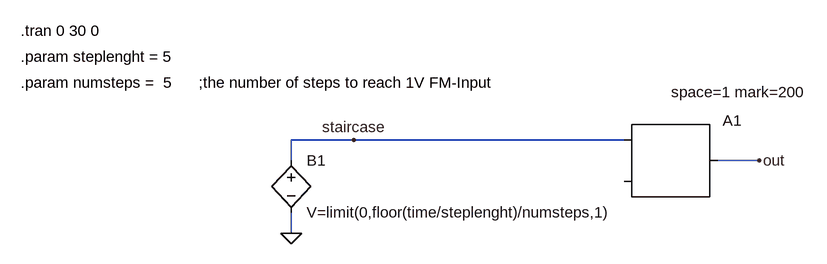
[diagram p0: schematic staircase2.asc]
staircase2.asc, the LTspice schematic file:
Version 4
SHEET 1 880 680
WIRE 160 64 64 64
WIRE 576 64 160 64
WIRE 64 96 64 64
WIRE 784 96 720 96
WIRE 64 208 64 176
FLAG 64 208 0
FLAG 160 64 staircase
FLAG 784 96 out
SYMBOL bv 64 80 R0
SYMATTR InstName B1
SYMATTR Value V=limit(0,floor(time/steplenght)/numsteps,1)
SYMBOL SpecialFunctions\\modulate 576 64 R0
WINDOW 3 73 -74 Left 0
SYMATTR InstName A1
SYMATTR Value space=1 mark=200
TEXT -352 -104 Left 0 !.tran 0 30 0
TEXT -352 -64 Left 0 !.param steplenght = 5
TEXT -352 -24 Left 0 !.param numsteps =  5      ;the number of steps to reach 1V FM-Input

The netlist it stands for:
* staircase2.asc
B1 staircase 0 V=limit(0,floor(time/steplenght)/numsteps,1)
A1 staircase 0 0 0 0 0 out 0 MODULATOR space=1 mark=200
.tran 0 30 0
.param steplenght = 5
.param numsteps =  5      ;the number of steps to reach 1V FM-Input
.backanno
.end